# Altium project RD15002SCT_Collection_20160216.PrjPcb
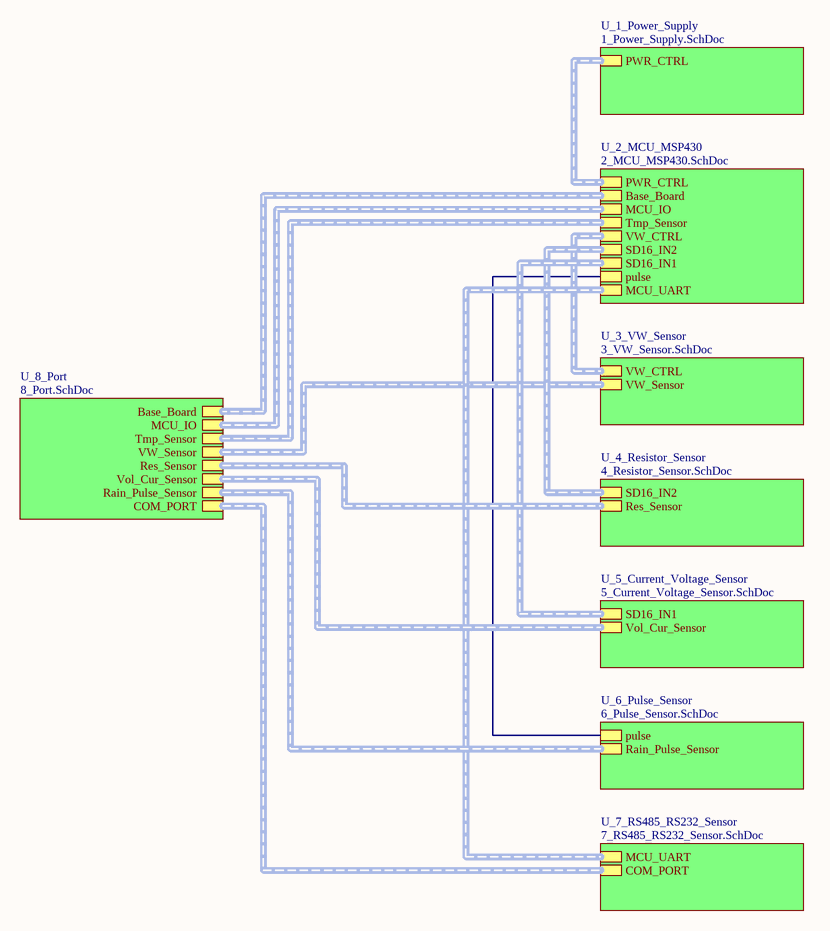
[diagram p0: RD15002SCT_Collection.SchDoc]
9 sheets, 184 parts. Net scope: hierarchical (ports join the sheet entries above them; power ports are global).
Board files: RD15002SCT_Collection.PcbDoc, RD15002SCT拼板20160225.PcbDoc
Sheets:
  RD15002SCT_Collection.SchDoc
    U_1_Power_Supply = 1_Power_Supply.SchDoc
    U_3_VW_Sensor = 3_VW_Sensor.SchDoc
    U_4_Resistor_Sensor = 4_Resistor_Sensor.SchDoc
    U_5_Current_Voltage_Sensor = 5_Current_Voltage_Sensor.SchDoc
    U_6_Pulse_Sensor = 6_Pulse_Sensor.SchDoc
    U_7_RS485_RS232_Sensor = 7_RS485_RS232_Sensor.SchDoc
    U_2_MCU_MSP430 = 2_MCU_MSP430.SchDoc
    U_8_Port = 8_Port.SchDoc

## Sheet RD15002SCT_Collection.SchDoc
size A4

### Sub-sheets
U_1_Power_Supply = 1_Power_Supply.SchDoc: PWR_CTRL (harness PWR_CTRL)
U_2_MCU_MSP430 = 2_MCU_MSP430.SchDoc: MCU_UART (harness MCU_UART), PWR_CTRL (harness PWR_CTRL), SD16_IN1 (harness SD16_IN1), SD16_IN2 (harness SD16_IN2), pulse, Tmp_Sensor (harness Tmp_Sensor), VW_CTRL (harness VW_CTRL), MCU_IO (harness MCU_IO), Base_Board (harness Base_Board)
U_3_VW_Sensor = 3_VW_Sensor.SchDoc: VW_CTRL (harness VW_CTRL), VW_Sensor (harness VW_Sensor)
U_4_Resistor_Sensor = 4_Resistor_Sensor.SchDoc: SD16_IN2 (harness SD16_IN2), Res_Sensor (harness Res_Sensor)
U_5_Current_Voltage_Sensor = 5_Current_Voltage_Sensor.SchDoc: SD16_IN1 (harness SD16_IN1), Vol_Cur_Sensor (harness Vol_Cur_Sensor)
U_6_Pulse_Sensor = 6_Pulse_Sensor.SchDoc: pulse, Rain_Pulse_Sensor (harness Rain_Pulse_Sensor)
U_7_RS485_RS232_Sensor = 7_RS485_RS232_Sensor.SchDoc: COM_PORT (harness COM_PORT), MCU_UART (harness MCU_UART)
U_8_Port = 8_Port.SchDoc: Rain_Pulse_Sensor (harness Rain_Pulse_Sensor), VW_Sensor (harness VW_Sensor), Vol_Cur_Sensor (harness Vol_Cur_Sensor), Tmp_Sensor (harness Tmp_Sensor), Res_Sensor (harness Res_Sensor), COM_PORT (harness COM_PORT), MCU_IO (harness MCU_IO), Base_Board (harness Base_Board)

### Nets
pulse: sheet U_6_Pulse_Sensor/pulse, sheet U_2_MCU_MSP430/pulse

### Buses and harness runs
harness sheet U_1_Power_Supply/PWR_CTRL = sheet U_2_MCU_MSP430/PWR_CTRL
harness sheet U_2_MCU_MSP430/Base_Board = sheet U_8_Port/Base_Board
harness sheet U_2_MCU_MSP430/MCU_IO = sheet U_8_Port/MCU_IO
harness sheet U_2_MCU_MSP430/MCU_UART = sheet U_7_RS485_RS232_Sensor/MCU_UART
harness sheet U_2_MCU_MSP430/SD16_IN1 = sheet U_5_Current_Voltage_Sensor/SD16_IN1
harness sheet U_2_MCU_MSP430/SD16_IN2 = sheet U_4_Resistor_Sensor/SD16_IN2
harness sheet U_2_MCU_MSP430/Tmp_Sensor = sheet U_8_Port/Tmp_Sensor
harness sheet U_2_MCU_MSP430/VW_CTRL = sheet U_3_VW_Sensor/VW_CTRL
harness sheet U_3_VW_Sensor/VW_Sensor = sheet U_8_Port/VW_Sensor
harness sheet U_4_Resistor_Sensor/Res_Sensor = sheet U_8_Port/Res_Sensor
harness sheet U_5_Current_Voltage_Sensor/Vol_Cur_Sensor = sheet U_8_Port/Vol_Cur_Sensor
harness sheet U_6_Pulse_Sensor/Rain_Pulse_Sensor = sheet U_8_Port/Rain_Pulse_Sensor
harness sheet U_7_RS485_RS232_Sensor/COM_PORT = sheet U_8_Port/COM_PORT

### Notes on the sheet
- 文件版本:
- 原理图名:
- 工 程  名:
- 绘       制:
- 审       核:
- 第   页，共    页
- 日       期:

## Sheet 1_Power_Supply.SchDoc
size A4
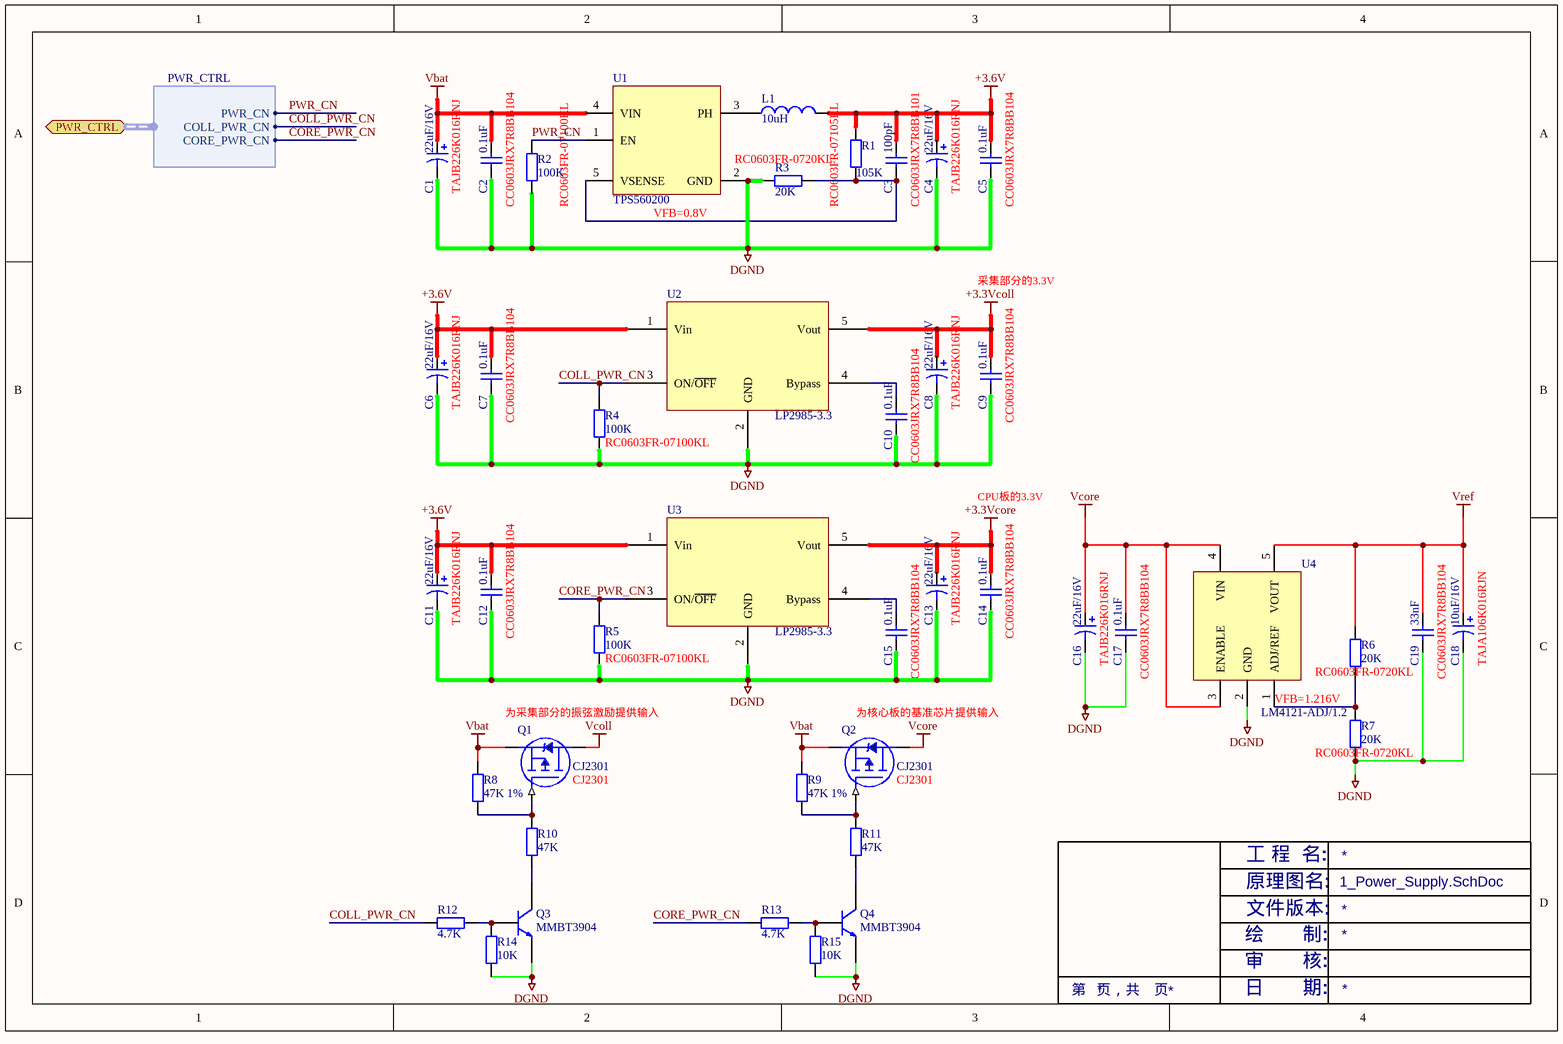
[diagram p1: 1_Power_Supply.SchDoc]

### Parts
C1  22uF/16V  Part No.: TAJB226K016RNJ  [CB3528]
C2  0.1uF  Type No.: CC0603JRX7R8BB104  [CC0603]
C3  100pF  Type No.: CC0603JRX7R8BB101  [CC0603]
C4  22uF/16V  Part No.: TAJB226K016RNJ  [CB3528]
C5  0.1uF  Type No.: CC0603JRX7R8BB104  [CC0603]
C6  22uF/16V  Part No.: TAJB226K016RNJ  [CB3528]
C7  0.1uF  Type No.: CC0603JRX7R8BB104  [CC0603]
C8  22uF/16V  Part No.: TAJB226K016RNJ  [CB3528]
C9  0.1uF  Type No.: CC0603JRX7R8BB104  [CC0603]
C10  0.1uF  Type No.: CC0603JRX7R8BB104  [CC0603]
C11  22uF/16V  Part No.: TAJB226K016RNJ  [CB3528]
C12  0.1uF  Type No.: CC0603JRX7R8BB104  [CC0603]
C13  22uF/16V  Part No.: TAJB226K016RNJ  [CB3528]
C14  0.1uF  Type No.: CC0603JRX7R8BB104  [CC0603]
C15  0.1uF  Type No.: CC0603JRX7R8BB104  [CC0603]
C16  22uF/16V  Part No.: TAJB226K016RNJ  [CB3528]
C17  0.1uF  Type No.: CC0603JRX7R8BB104  [CC0603]
C18  10uF/16V  Type No.: TAJA106K016RJN  [CA3216]
C19  33nF  Type No.: CC0603JRX7R8BB104  [CC0603]
L1  10uH  [SLF6025]
Q1  CJ2301  [SOT-23W]
Q2  CJ2301  [SOT-23W]
Q3  MMBT3904  [SOT-23W]
Q4  MMBT3904  [SOT-23W]
R1  105K  Type No.: RC0603FR-07105KL  [CC0603]
R2  100K  Type No.: RC0603FR-07100KL  [CC0603]
R3  20K  Type No.: RC0603FR-0720KL  [CC0603]
R4  100K  Type No.: RC0603FR-07100KL  [CC0603]
R5  100K  Type No.: RC0603FR-07100KL  [CC0603]
R6  20K  Type No.: RC0603FR-0720KL  [CC0603]
R7  20K  Type No.: RC0603FR-0720KL  [CC0603]
R8  47K 1%  [CC0603]
R9  47K 1%  [CC0603]
R10  47K  [CC0603]
R11  47K  [CC0603]
R12  4.7K  [CC0603]
R13  4.7K  [CC0603]
R14  10K  [CC0603]
R15  10K  [CC0603]
U1  TPS560200  [SOT-23-5]
U2  LP2985-3.3  [SOT-23-5]
U3  LP2985-3.3  [SOT-23-5]
U4  LM4121-ADJ/1.2  [SOT-23-5]

### Ports
PWR_CTRL (harness PWR_CTRL)

### Harnesses
PWR_CTRL: PWR_CN, COLL_PWR_CN, CORE_PWR_CN

### Nets
+3.3Vcoll: C8.1 C9.2 U2.5(Vout)
+3.3Vcore: C13.1 C14.2 U3.5(Vout)
+3.6V: C3.2 C4.1 C5.2 C6.1 C7.2 C11.1 C12.2 L1.2 R1.1 U2.1(Vin) U3.1(Vin)
DGND: C1.2 C2.1 C4.2 C5.1 C6.2 C7.1 C8.2 C9.1 C10.1 C11.2 C12.1 C13.2 C14.1 C15.1 C16.2 C17.1 C18.2 C19.1 Q3.2 Q4.2 R2.2 R3.2 R4.2 R5.2 R7.2 R14.2 R15.2 U1.2(GND) U2.2(GND) U3.2(GND) U4.2(GND)
Vbat: C1.1 C2.2 Q1.2(SOURCE) Q2.2(SOURCE) R8.1 R9.1 U1.4(VIN)
Vcoll: Q1.3(DRAIN)
Vcore: C16.1 C17.2 Q2.3(DRAIN) U4.3(ENABLE) U4.4(VIN)
Vref: C18.1 C19.2 R6.1 U4.5(VOUT)
COLL_PWR_CN: R4.1 R12.1 U2.3(ON/~{OFF}) ; port PWR_CTRL.COLL_PWR_CN
CORE_PWR_CN: R5.1 R13.1 U3.3(ON/~{OFF}) ; port PWR_CTRL.CORE_PWR_CN
PWR_CN: R2.1 U1.1(EN) ; port PWR_CTRL.PWR_CN
NetC3_1: C3.1 R1.2 R3.1 U1.5(VSENSE)
NetC10_2: C10.2 U2.4(Bypass)
NetC15_2: C15.2 U3.4(Bypass)
NetL1_1: L1.1 U1.3(PH)
NetQ1_1: Q1.1(GATE) R8.2 R10.1
NetQ2_1: Q2.1(GATE) R9.2 R11.1
NetQ3_1: Q3.1 R12.2 R14.1
NetQ3_3: Q3.3 R10.2
NetQ4_1: Q4.1 R13.2 R15.1
NetQ4_3: Q4.3 R11.2
NetR6_2: R6.2 R7.1 U4.1(ADJ/REF)

### Notes on the sheet
- (near U1) VFB=0.8V
- 采集部分的3.3V
- CPU板的3.3V
- (near Q1) 为采集部分的振弦激励提供输入
- (near Q2) 为核心板的基准芯片提供输入
- (near U4) VFB=1.216V
- 文件版本:
- 原理图名:
- 工 程  名:
- 绘       制:
- 审       核:
- 第   页，共    页
- 日       期:

### Library data of the parts
C1 C4 C6 C8 C11 C13 C16 C18 = Cap Pol1: Polarized Capacitor (Radial)
C2 C3 C5 C7 C9 C10 C12 C14 C15 C17 C19 = Cap: Capacitor
L1 = Inductor: Code_IEC: 1005; Value: 10mH; Published: 8-Jun-2000; LatestRevisionDate: 29-May-2009; LatestRevisionNote: IPC-7351 Footprint Added.; PackageReference: 0402-A; Publisher: Altium Limited; PackageDescription: Chip Inductor; Code_JEITA: 0402
Q1 Q2 = P-MOSFET1: Type No.: CJ2301
Q3 Q4 = NPN
R1-R7 R14 R15 = Res2: Resistor
  R14 R15: Published: 8-Jun-2000; LatestRevisionDate: 17-Jul-2002; LatestRevisionNote: Re-released for DXP Platform.; PackageReference: AXIAL-0.4; Publisher: Altium Limited; PackageDescription: Axial Device, Thru-Hole; 2 Leads; 0.4 in Pin Spacing; Value: 10K
R8-R13 = Res2: Resistor; Value: 10K; Published: 8-Jun-2000; LatestRevisionDate: 17-Jul-2002; LatestRevisionNote: Re-released for DXP Platform.; PackageReference: AXIAL-0.4; Publisher: Altium Limited; PackageDescription: Axial Device, Thru-Hole; 2 Leads; 0.4 in Pin Spacing
U2 U3 = LP2985

## Sheet 3_VW_Sensor.SchDoc
size A4
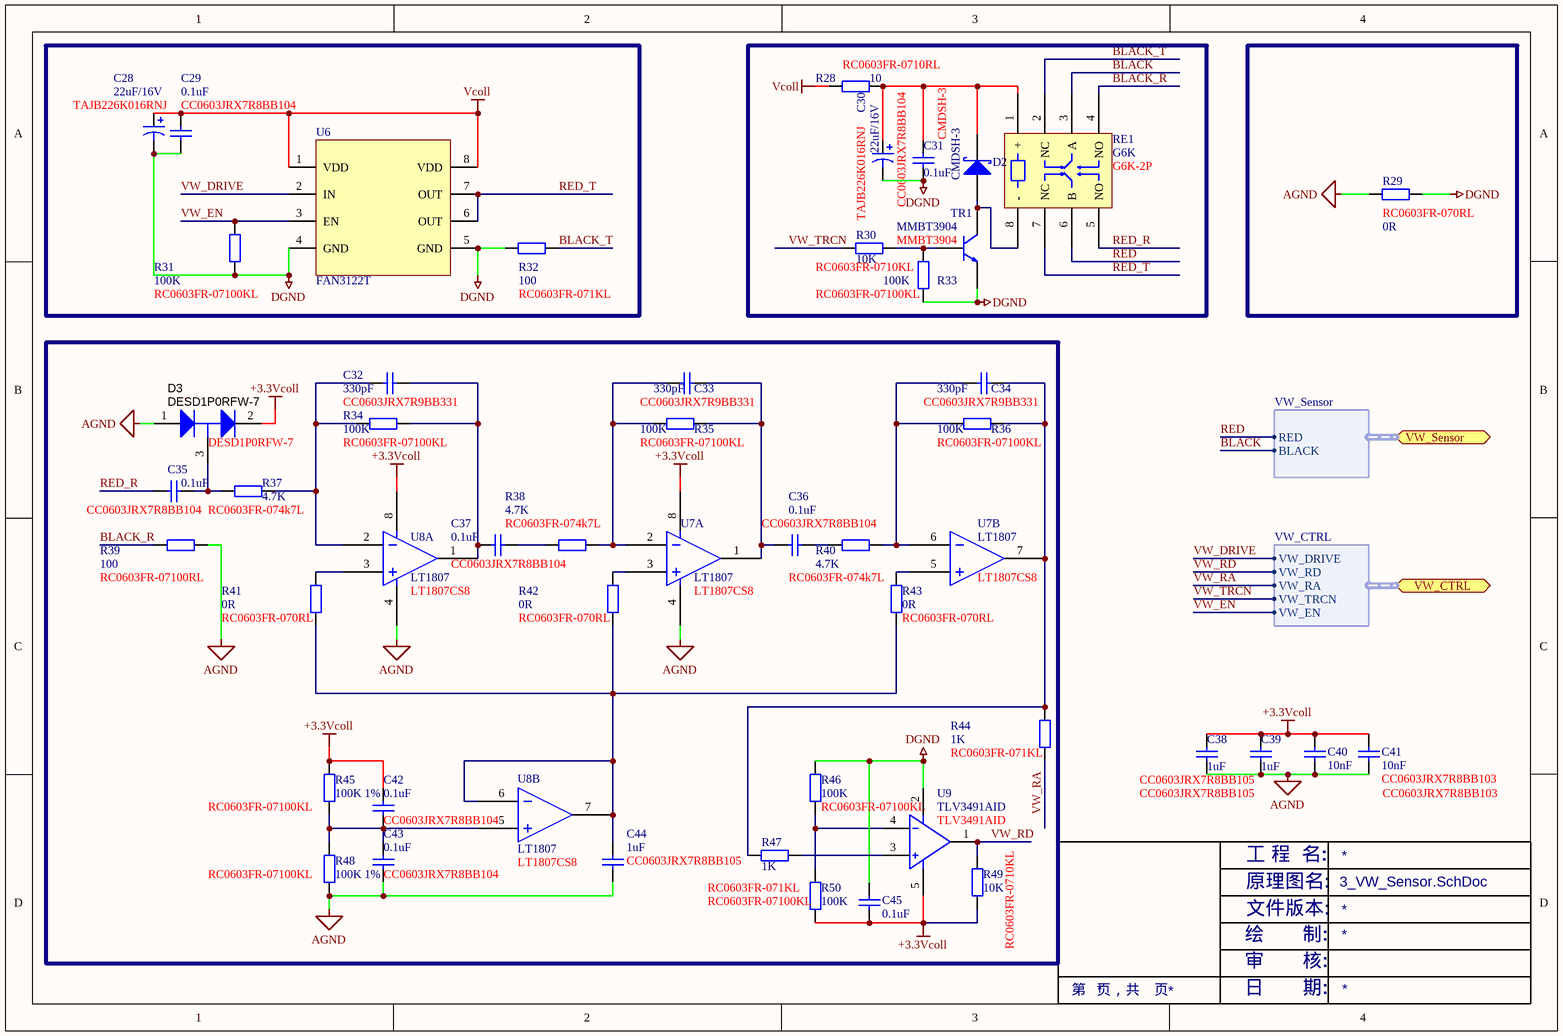
[diagram p2: 3_VW_Sensor.SchDoc]

### Parts
C28  22uF/16V  Part No.: TAJB226K016RNJ  [CB3528]
C29  0.1uF  Type No.: CC0603JRX7R8BB104  [CC0603]
C30  22uF/16V  Part No.: TAJB226K016RNJ  [CB3528]
C31  0.1uF  Type No.: CC0603JRX7R8BB104  [CC0603]
C32  330pF  Type No.: CC0603JRX7R9BB331  [CC0603]
C33  330pF  Type No.: CC0603JRX7R9BB331  [CC0603]
C34  330pF  Type No.: CC0603JRX7R9BB331  [CC0603]
C35  0.1uF  Type No.: CC0603JRX7R8BB104  [CC0603]
C36  0.1uF  Type No.: CC0603JRX7R8BB104  [CC0603]
C37  0.1uF  Type No.: CC0603JRX7R8BB104  [CC0603]
C38  1uF  Type No.: CC0603JRX7R8BB105  [CC0603]
C39  1uF  Type No.: CC0603JRX7R8BB105  [CC0603]
C40  10nF  Type No.: CC0603JRX7R8BB103  [CC0603]
C41  10nF  Type No.: CC0603JRX7R8BB103  [CC0603]
C42  0.1uF  Type No.: CC0603JRX7R8BB104  [CC0603]
C43  0.1uF  Type No.: CC0603JRX7R8BB104  [CC0603]
C44  1uF  Type No.: CC0603JRX7R8BB105  [CC0603]
C45  0.1uF  [CC0603]
D2  CMDSH-3  [SOD323]
D3  DESD1P0RFW-7  [SOT-323]
R28  10  Type No.: RC0603FR-0710RL  [CC0603]
R29  0R  Type No.: RC0603FR-070RL  [CC0603]
R30  10K  Type No.: RC0603FR-0710KL  [CC0603]
R31  100K  Type No.: RC0603FR-07100KL  [CC0603]
R32  100  Type No.: RC0603FR-071KL  [CC0603]
R33  100K  Type No.: RC0603FR-07100KL  [CC0603]
R34  100K  Type No.: RC0603FR-07100KL  [CC0603]
R35  100K  Type No.: RC0603FR-07100KL  [CC0603]
R36  100K  Type No.: RC0603FR-07100KL  [CC0603]
R37  4.7K  Type No.: RC0603FR-074k7L  [CC0603]
R38  4.7K  Type No.: RC0603FR-074k7L  [CC0603]
R39  100  Type No.: RC0603FR-07100RL  [CC0603]
R40  4.7K  Type No.: RC0603FR-074k7L  [CC0603]
R41  0R  Type No.: RC0603FR-070RL  [CC0603]
R42  0R  Type No.: RC0603FR-070RL  [CC0603]
R43  0R  Type No.: RC0603FR-070RL  [CC0603]
R44  1K  Type No.: RC0603FR-071KL  [CC0603]
R45  100K 1%  Type No.: RC0603FR-07100KL  [CC0603]
R46  100K  Type No.: RC0603FR-07100KL  [CC0603]
R47  1K  Type No.: RC0603FR-071KL  [CC0603]
R48  100K 1%  Type No.: RC0603FR-07100KL  [CC0603]
R49  10K  Type No.: RC0603FR-0710KL  [CC0603]
R50  100K  Type No.: RC0603FR-07100KL  [CC0603]
RE1  G6K  Type No.: G6K-2P  [G6K]
TR1  MMBT3904  [SOT-23W]
U6  FAN3122T  [SO-8]
U7  LT1807  Type No.: LT1807CS8  [SO-8]  (parts A,B of 2)
U8  LT1807  Type No.: LT1807CS8  [SO-8]  (parts A,B of 2)
U9  TLV3491AID  [SOT-23-5]

### Ports
VW_CTRL (harness VW_CTRL), VW_Sensor (harness VW_Sensor)

### Harnesses
VW_CTRL: VW_RA, VW_DRIVE, VW_TRCN, VW_EN, VW_RD
VW_Sensor: RED, BLACK

### Nets
+3.3Vcoll: C38.2 C39.2 C40.1 C41.1 C42.1 C45.2 D3.2(K) R45.1 R49.1 R50.1 U7.8 U8.8 U9.5(+VS)
AGND: C38.1 C39.1 C40.2 C41.2 C43.2 C44.1 D3.1(A) R29.1 R39.2 R48.2 U7.4 U8.4
DGND: C28.2 C29.1 C30.2 C31.2 C45.1 R29.2 R31.2 R32.2 R33.1 R46.2 TR1.2 U6.4(GND) U6.5(GND) U9.2(-VS)
Vcoll: C28.1 C29.2 R28.1 U6.1(VDD) U6.8(VDD)
BLACK: RE1.3(A) ; port VW_Sensor.BLACK
BLACK_R: R39.1 RE1.4(NO)
BLACK_T: R32.1 RE1.2(NC)
RED: RE1.6(B) ; port VW_Sensor.RED
RED_R: C35.2 RE1.5(NO)
RED_T: RE1.7(NC) U6.6(OUT) U6.7(OUT)
VW_DRIVE: U6.2(IN) ; port VW_CTRL.VW_DRIVE
VW_EN: R31.1 U6.3(EN) ; port VW_CTRL.VW_EN
VW_RA: R44.2 ; port VW_CTRL.VW_RA
VW_RD: R49.2 U9.1(OUT) ; port VW_CTRL.VW_RD
VW_TRCN: R30.1 ; port VW_CTRL.VW_TRCN
NetC30_1: C30.1 C31.1 D2.2(K) R28.2 RE1.1(+)
NetC32_1: C32.1 C37.2 R34.1 U8.1
NetC32_2: C32.2 R34.2 R37.1 U8.2
NetC33_1: C33.1 C36.2 R35.1 U7.1
NetC33_2: C33.2 R35.2 R38.1 U7.2
NetC34_1: C34.1 R36.1 R44.1 R47.2 U7.7
NetC34_2: C34.2 R36.2 R40.1 U7.6
NetC35_1: C35.1 D3.3(C) R37.2
NetC36_1: C36.1 R40.2
NetC37_1: C37.1 R38.2
NetC42_2: C42.2 C43.1 R45.2 R48.1 U8.5
NetC44_2: C44.2 R41.2 R42.2 R43.2 U8.6 U8.7
NetD2_1: D2.1(A) RE1.8(-) TR1.3
NetR30_2: R30.2 R33.2 TR1.1
NetR41_1: R41.1 U8.3
NetR42_1: R42.1 U7.3
NetR43_1: R43.1 U7.5
NetR46_1: R46.1 R50.2 U9.4(-)
NetR47_1: R47.1 U9.3(+)

### Notes on the sheet
- 文件版本:
- 原理图名:
- 工 程  名:
- 绘       制:
- 审       核:
- 第   页，共    页
- 日       期:

### Library data of the parts
C28 C30 = Cap Pol1: Polarized Capacitor (Radial)
C29 C31-C45 = Cap: Capacitor
  C45: Published: 8-Jun-2000; LatestRevisionDate: 17-Jul-2002; LatestRevisionNote: Re-released for DXP Platform.; PackageReference: RAD-0.3; Publisher: Altium Limited; Value: 0.1uF
D2 = D Schottky: Schottky Diode; Type No.: CMDSH-3
D3 = BAV99WT1G: TVS DIODE,70VVVM,8VC,SOT-323; Type No.: DESD1P0RFW-7
R28-R50 = Res2: Resistor
TR1 = NPN: Type No.: MMBT3904
U6 = FAN3122
U7 U8 = LM833N
U9 = TLV3491AID: Type No.: TLV3491AID

## Sheet 4_Resistor_Sensor.SchDoc
size A4
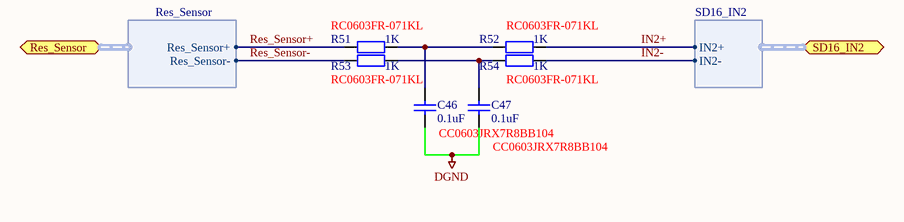
[diagram p3: 4_Resistor_Sensor.SchDoc]

### Parts
C46  0.1uF  Type No.: CC0603JRX7R8BB104  [CC0603]
C47  0.1uF  Type No.: CC0603JRX7R8BB104  [CC0603]
R51  1K  Type No.: RC0603FR-071KL  [CC0603]
R52  1K  Type No.: RC0603FR-071KL  [CC0603]
R53  1K  Type No.: RC0603FR-071KL  [CC0603]
R54  1K  Type No.: RC0603FR-071KL  [CC0603]

### Ports
Res_Sensor (harness Res_Sensor), SD16_IN2 (harness SD16_IN2)

### Harnesses
SD16_IN2: IN2+, IN2-
Res_Sensor: Res_Sensor+, Res_Sensor-

### Nets
DGND: C46.2 C47.2
IN2+: R52.1 ; port SD16_IN2.IN2+
IN2-: R54.1 ; port SD16_IN2.IN2-
Res_Sensor+: R51.2 ; port Res_Sensor.Res_Sensor+
Res_Sensor-: R53.2 ; port Res_Sensor.Res_Sensor-
NetC46_1: C46.1 R51.1 R52.2
NetC47_1: C47.1 R53.1 R54.2

### Notes on the sheet
- 文件版本:
- 原理图名:
- 工 程  名:
- 绘       制:
- 审       核:
- 第   页，共    页
- 日       期:

### Library data of the parts
C46 C47 = Cap: Capacitor
R51-R54 = Res2: Resistor

## Sheet 5_Current_Voltage_Sensor.SchDoc
size A4
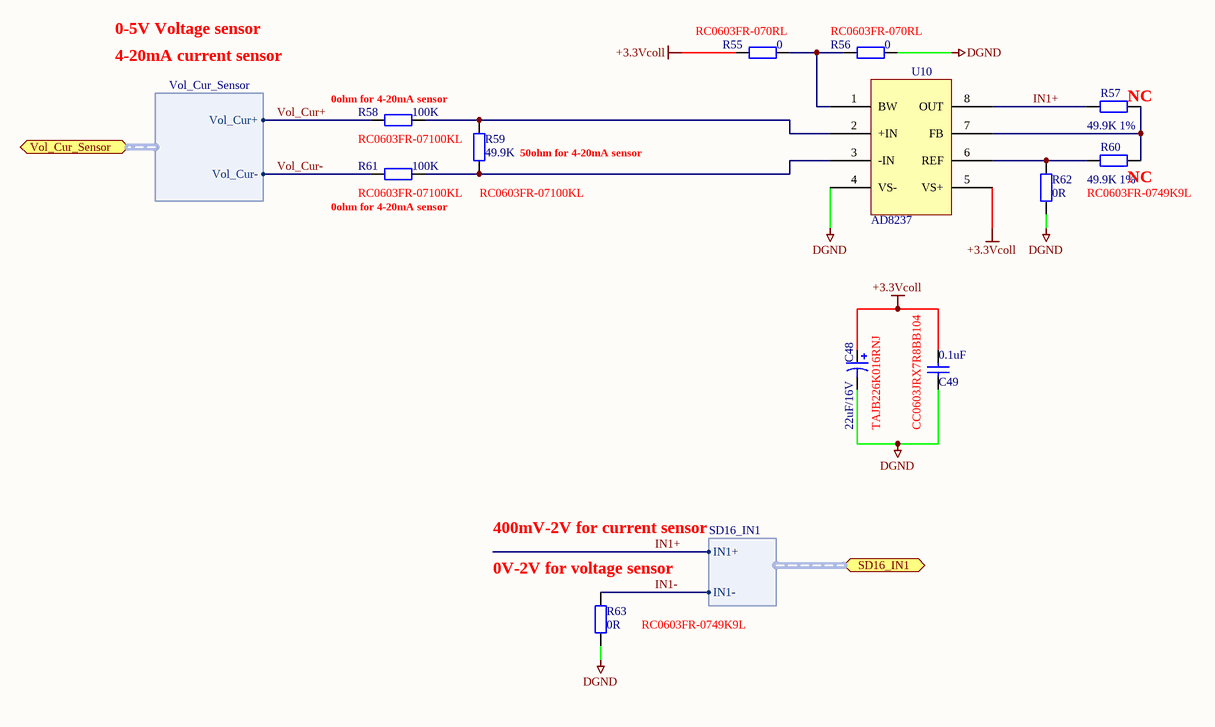
[diagram p4: 5_Current_Voltage_Sensor.SchDoc]

### Parts
C48  22uF/16V  Part No.: TAJB226K016RNJ  [CB3528]
C49  0.1uF  Type No.: CC0603JRX7R8BB104  [CC0603]
R55  0  Type No.: RC0603FR-070RL  [CC0603]
R56  0  Type No.: RC0603FR-070RL  [CC0603]
R57  49.9K 1%  [CC0603]
R58  100K  Type No.: RC0603FR-07100KL  [CC0603]
R59  49.9K  Type No.: RC0603FR-07100KL  [CC0603]
R60  49.9K 1%  [CC0603]
R61  100K  Type No.: RC0603FR-07100KL  [CC0603]
R62  0R  Type No.: RC0603FR-0749K9L  [CC0603]
R63  0R  Type No.: RC0603FR-0749K9L  [CC0603]
U10  AD8237  [MSOP8]

### Ports
SD16_IN1 (harness SD16_IN1), Vol_Cur_Sensor (harness Vol_Cur_Sensor)

### Harnesses
SD16_IN1: IN1+, IN1-
Vol_Cur_Sensor: Vol_Cur+, Vol_Cur-

### Nets
+3.3Vcoll: C48.1 C49.2 R55.2 U10.5(VS+)
DGND: C48.2 C49.1 R56.1 R62.2 R63.2 U10.4(VS-)
IN1+: R57.2 U10.8(OUT) ; port SD16_IN1.IN1+
IN1-: R63.1 ; port SD16_IN1.IN1-
Vol_Cur+: R58.2 ; port Vol_Cur_Sensor.Vol_Cur+
Vol_Cur-: R61.2 ; port Vol_Cur_Sensor.Vol_Cur-
NetR55_1: R55.1 R56.2 U10.1(BW)
NetR57_1: R57.1 R60.1 U10.7(FB)
NetR58_1: R58.1 R59.1 U10.2(+IN)
NetR59_2: R59.2 R61.1 U10.3(-IN)
NetR60_2: R60.2 R62.1 U10.6(REF)

### Notes on the sheet
- 0-5V Voltage sensor
- 4-20mA current sensor
- (near R58) 0ohm for 4-20mA sensor
- (near R57) NC
- (near R59) 50ohm for 4-20mA sensor
- (near R61) 0ohm for 4-20mA sensor
- (near R60) NC
- 400mV-2V for current sensor
- (near R63) 0V-2V for voltage sensor
- 文件版本:
- 原理图名:
- 工 程  名:
- 绘       制:
- 审       核:
- 第   页，共    页
- 日       期:

### Library data of the parts
C48 = Cap Pol1: Polarized Capacitor (Radial)
C49 = Cap: Capacitor
R55 R56 R58 R59 R61-R63 = Res2: Resistor
R57 R60 = Res2: Resistor; Value: 1K; Published: 8-Jun-2000; LatestRevisionDate: 17-Jul-2002; LatestRevisionNote: Re-released for DXP Platform.; PackageReference: AXIAL-0.4; Publisher: Altium Limited
U10 = AD8237: Type No.: AD8237ARMZ

## Sheet 6_Pulse_Sensor.SchDoc
size A4
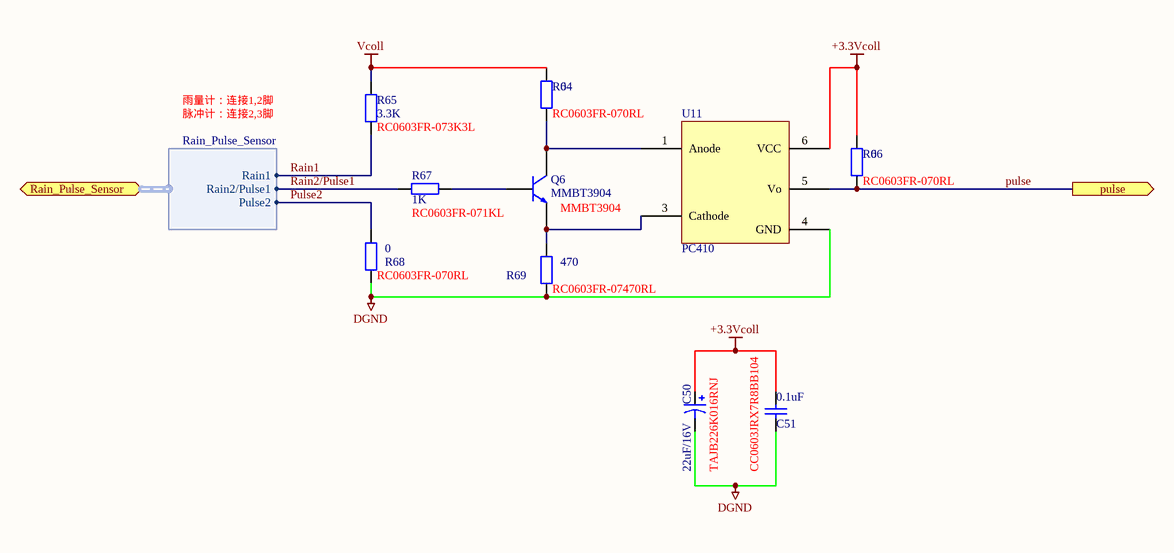
[diagram p5: 6_Pulse_Sensor.SchDoc]

### Parts
C50  22uF/16V  Part No.: TAJB226K016RNJ  [CB3528]
C51  0.1uF  Type No.: CC0603JRX7R8BB104  [CC0603]
Q6  MMBT3904  [SOT-23W]
R64  0  Type No.: RC0603FR-070RL  [CC0603]
R65  3.3K  Type No.: RC0603FR-073K3L  [CC0603]
R66  0  Type No.: RC0603FR-070RL  [CC0603]
R67  1K  Type No.: RC0603FR-071KL  [CC0603]
R68  0  Type No.: RC0603FR-070RL  [CC0603]
R69  470  Type No.: RC0603FR-07470RL  [CC0603]
U11  PC410  [PC410]

### Ports
pulse, Rain_Pulse_Sensor (harness Rain_Pulse_Sensor)

### Harnesses
Rain_Pulse_Sensor: Rain1, Rain2/Pulse1, Pulse2

### Nets
+3.3Vcoll: C50.1 C51.2 R66.1 U11.6(VCC)
DGND: C50.2 C51.1 R68.2 R69.2 U11.4(GND)
Vcoll: R64.1 R65.1
pulse: R66.2 U11.5(Vo) ; port pulse
Pulse2: R68.1 ; port Rain_Pulse_Sensor.Pulse2
Rain1: R65.2 ; port Rain_Pulse_Sensor.Rain1
Rain2/Pulse1: R67.1 ; port Rain_Pulse_Sensor.Rain2/Pulse1
NetQ6_1: Q6.1 R67.2
NetQ6_2: Q6.2 R69.1 U11.3(Cathode)
NetQ6_3: Q6.3 R64.2 U11.1(Anode)

### Notes on the sheet
- 雨量计：连接1,2脚
- 脉冲计：连接2,3脚
- 文件版本:
- 原理图名:
- 工 程  名:
- 绘       制:
- 审       核:
- 第   页，共    页
- 日       期:

### Library data of the parts
C50 = Cap Pol1: Polarized Capacitor (Radial)
C51 = Cap: Capacitor
Q6 = NPN: Type No.: MMBT3904
R64-R69 = Res2: Resistor

## Sheet 7_RS485_RS232_Sensor.SchDoc
size A4
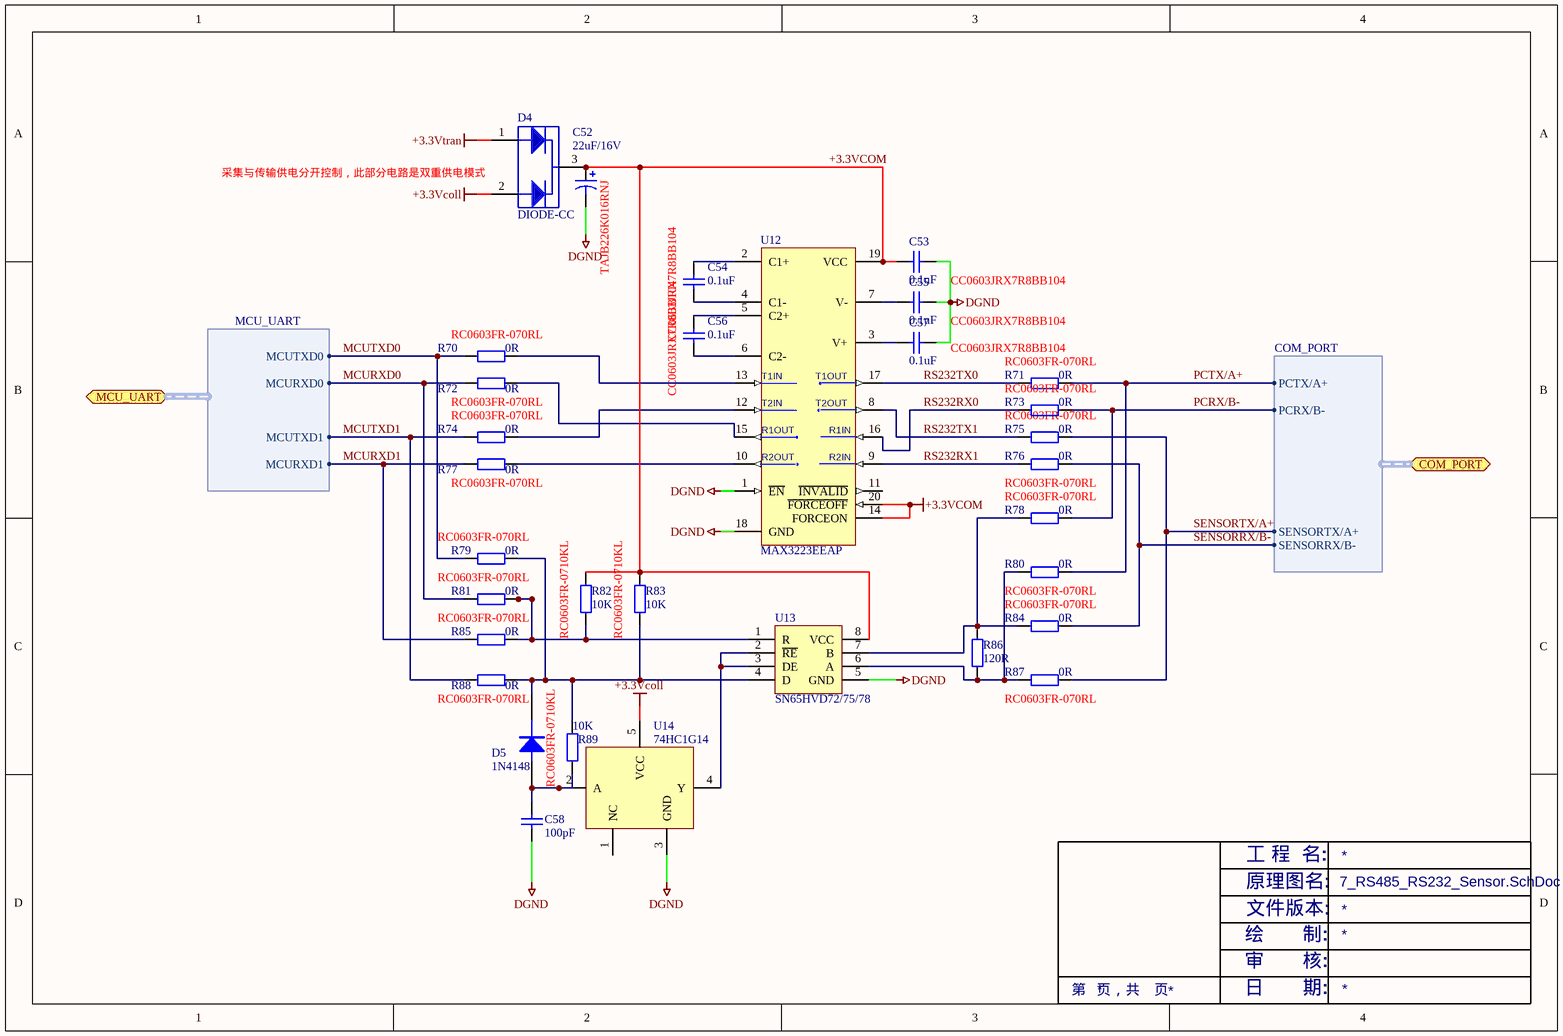
[diagram p6: 7_RS485_RS232_Sensor.SchDoc]

### Parts
C52  22uF/16V  Part No.: TAJB226K016RNJ  [CB3528]
C53  0.1uF  Type No.: CC0603JRX7R8BB104  [CC0603]
C54  0.1uF  Type No.: CC0603JRX7R8BB104  [CC0603]
C55  0.1uF  Type No.: CC0603JRX7R8BB104  [CC0603]
C56  0.1uF  Type No.: CC0603JRX7R8BB104  [CC0603]
C57  0.1uF  Type No.: CC0603JRX7R8BB104  [CC0603]
C58  100pF  [CC0603]
D4  DIODE-CC  [SOT-23W]
D5  1N4148  [SOD323]
R70  0R  Type No.: RC0603FR-070RL  [CC0603]
R71  0R  Type No.: RC0603FR-070RL  [CC0603]
R72  0R  Type No.: RC0603FR-070RL  [CC0603]
R73  0R  Type No.: RC0603FR-070RL  [CC0603]
R74  0R  Type No.: RC0603FR-070RL  [CC0603]
R75  0R  Type No.: RC0603FR-070RL  [CC0603]
R76  0R  Type No.: RC0603FR-070RL  [CC0603]
R77  0R  Type No.: RC0603FR-070RL  [CC0603]
R78  0R  Type No.: RC0603FR-070RL  [CC0603]
R79  0R  Type No.: RC0603FR-070RL  [CC0603]
R80  0R  Type No.: RC0603FR-070RL  [CC0603]
R81  0R  Type No.: RC0603FR-070RL  [CC0603]
R82  10K  Type No.: RC0603FR-0710KL  [CC0603]
R83  10K  Type No.: RC0603FR-0710KL  [CC0603]
R84  0R  Type No.: RC0603FR-070RL  [CC0603]
R85  0R  Type No.: RC0603FR-070RL  [CC0603]
R86  120R  [CC0603]
R87  0R  Type No.: RC0603FR-070RL  [CC0603]
R88  0R  Type No.: RC0603FR-070RL  [CC0603]
R89  10K  Type No.: RC0603FR-0710KL  [CC0603]
U12  MAX3223EEAP  [TSSOP20]
U13  SN65HVD72/75/78  [SO-8]
U14  74HC1G14  [SOT-23-5]

### Ports
COM_PORT (harness COM_PORT), MCU_UART (harness MCU_UART)

### Harnesses
MCU_UART: MCUTXD1, MCURXD1, MCURXD0, MCUTXD0
COM_PORT: PCTX/A+, PCRX/B-, SENSORRX/B-, SENSORTX/A+

### Nets
+3.3Vcoll: D4.2 U14.5(VCC)
+3.3VCOM: C52.1 C53.2 D4.3 R82.2 R83.2 U12.14(FORCEON) U12.19(VCC) U12.20(~{FORCEOFF}) U13.8(VCC)
+3.3Vtran: D4.1
DGND: C52.2 C53.1 C55.1 C57.1 C58.1 U12.1(~{EN}) U12.18(GND) U13.5(GND) U14.3(GND)
MCURXD0: R72.1 R81.1 ; port MCU_UART.MCURXD0
MCURXD1: R77.1 R85.1 ; port MCU_UART.MCURXD1
MCUTXD0: R70.1 R79.1 ; port MCU_UART.MCUTXD0
MCUTXD1: R74.1 R88.1 ; port MCU_UART.MCUTXD1
PCRX/B-: R73.2 R78.2 ; port COM_PORT.PCRX/B-
PCTX/A+: R71.2 R80.2 ; port COM_PORT.PCTX/A+
RS232RX0: R73.1 U12.16(R1IN)
RS232RX1: R76.1 U12.9(R2IN)
RS232TX0: R71.1 U12.17(T1OUT)
RS232TX1: R75.1 U12.8(T2OUT)
SENSORRX/B-: R76.2 R84.2 ; port COM_PORT.SENSORRX/B-
SENSORTX/A+: R75.2 R87.2 ; port COM_PORT.SENSORTX/A+
NetC54_1: C54.1 U12.4(C1-)
NetC54_2: C54.2 U12.2(C1+)
NetC55_2: C55.2 U12.7(V-)
NetC56_1: C56.1 U12.6(C2-)
NetC56_2: C56.2 U12.5(C2+)
NetC57_2: C57.2 U12.3(V+)
NetC58_2: C58.2 D5.1(A) R89.1 U14.2(A)
NetD5_2: D5.2(K) R79.2 R83.1 R88.2 R89.2 U13.4(D)
NetR70_2: R70.2 U12.13(T1IN)
NetR72_2: R72.2 U12.15(R1OUT)
NetR74_2: R74.2 U12.12(T2IN)
NetR77_2: R77.2 U12.10(R2OUT)
NetR78_1: R78.1 R84.1 R86.2 U13.7(B)
NetR80_1: R80.1 R86.1 R87.1 U13.6(A)
NetR81_2: R81.2 R82.1 R85.2 U13.1(R)
NetU13_2: U13.2(~{RE}) U13.3(DE) U14.4(Y)

Not connected (* = marked no-connect by the designer): U12 11(~{INVALID}); U14 1(NC)

### Notes on the sheet
- 采集与传输供电分开控制，此部分电路是双重供电模式
- 文件版本:
- 原理图名:
- 工 程  名:
- 绘       制:
- 审       核:
- 第   页，共    页
- 日       期:

### Library data of the parts
C52 = Cap Pol1: Polarized Capacitor (Radial)
C53-C58 = Cap: Capacitor
D5 = DIODE
R70-R85 R87-R89 = Res2: Resistor
R86 = Res2: Resistor; Value: 1K; Published: 8-Jun-2000; LatestRevisionDate: 17-Jul-2002; LatestRevisionNote: Re-released for DXP Platform.; PackageReference: AXIAL-0.4; Publisher: Altium Limited

## Sheet 2_MCU_MSP430.SchDoc
size A3
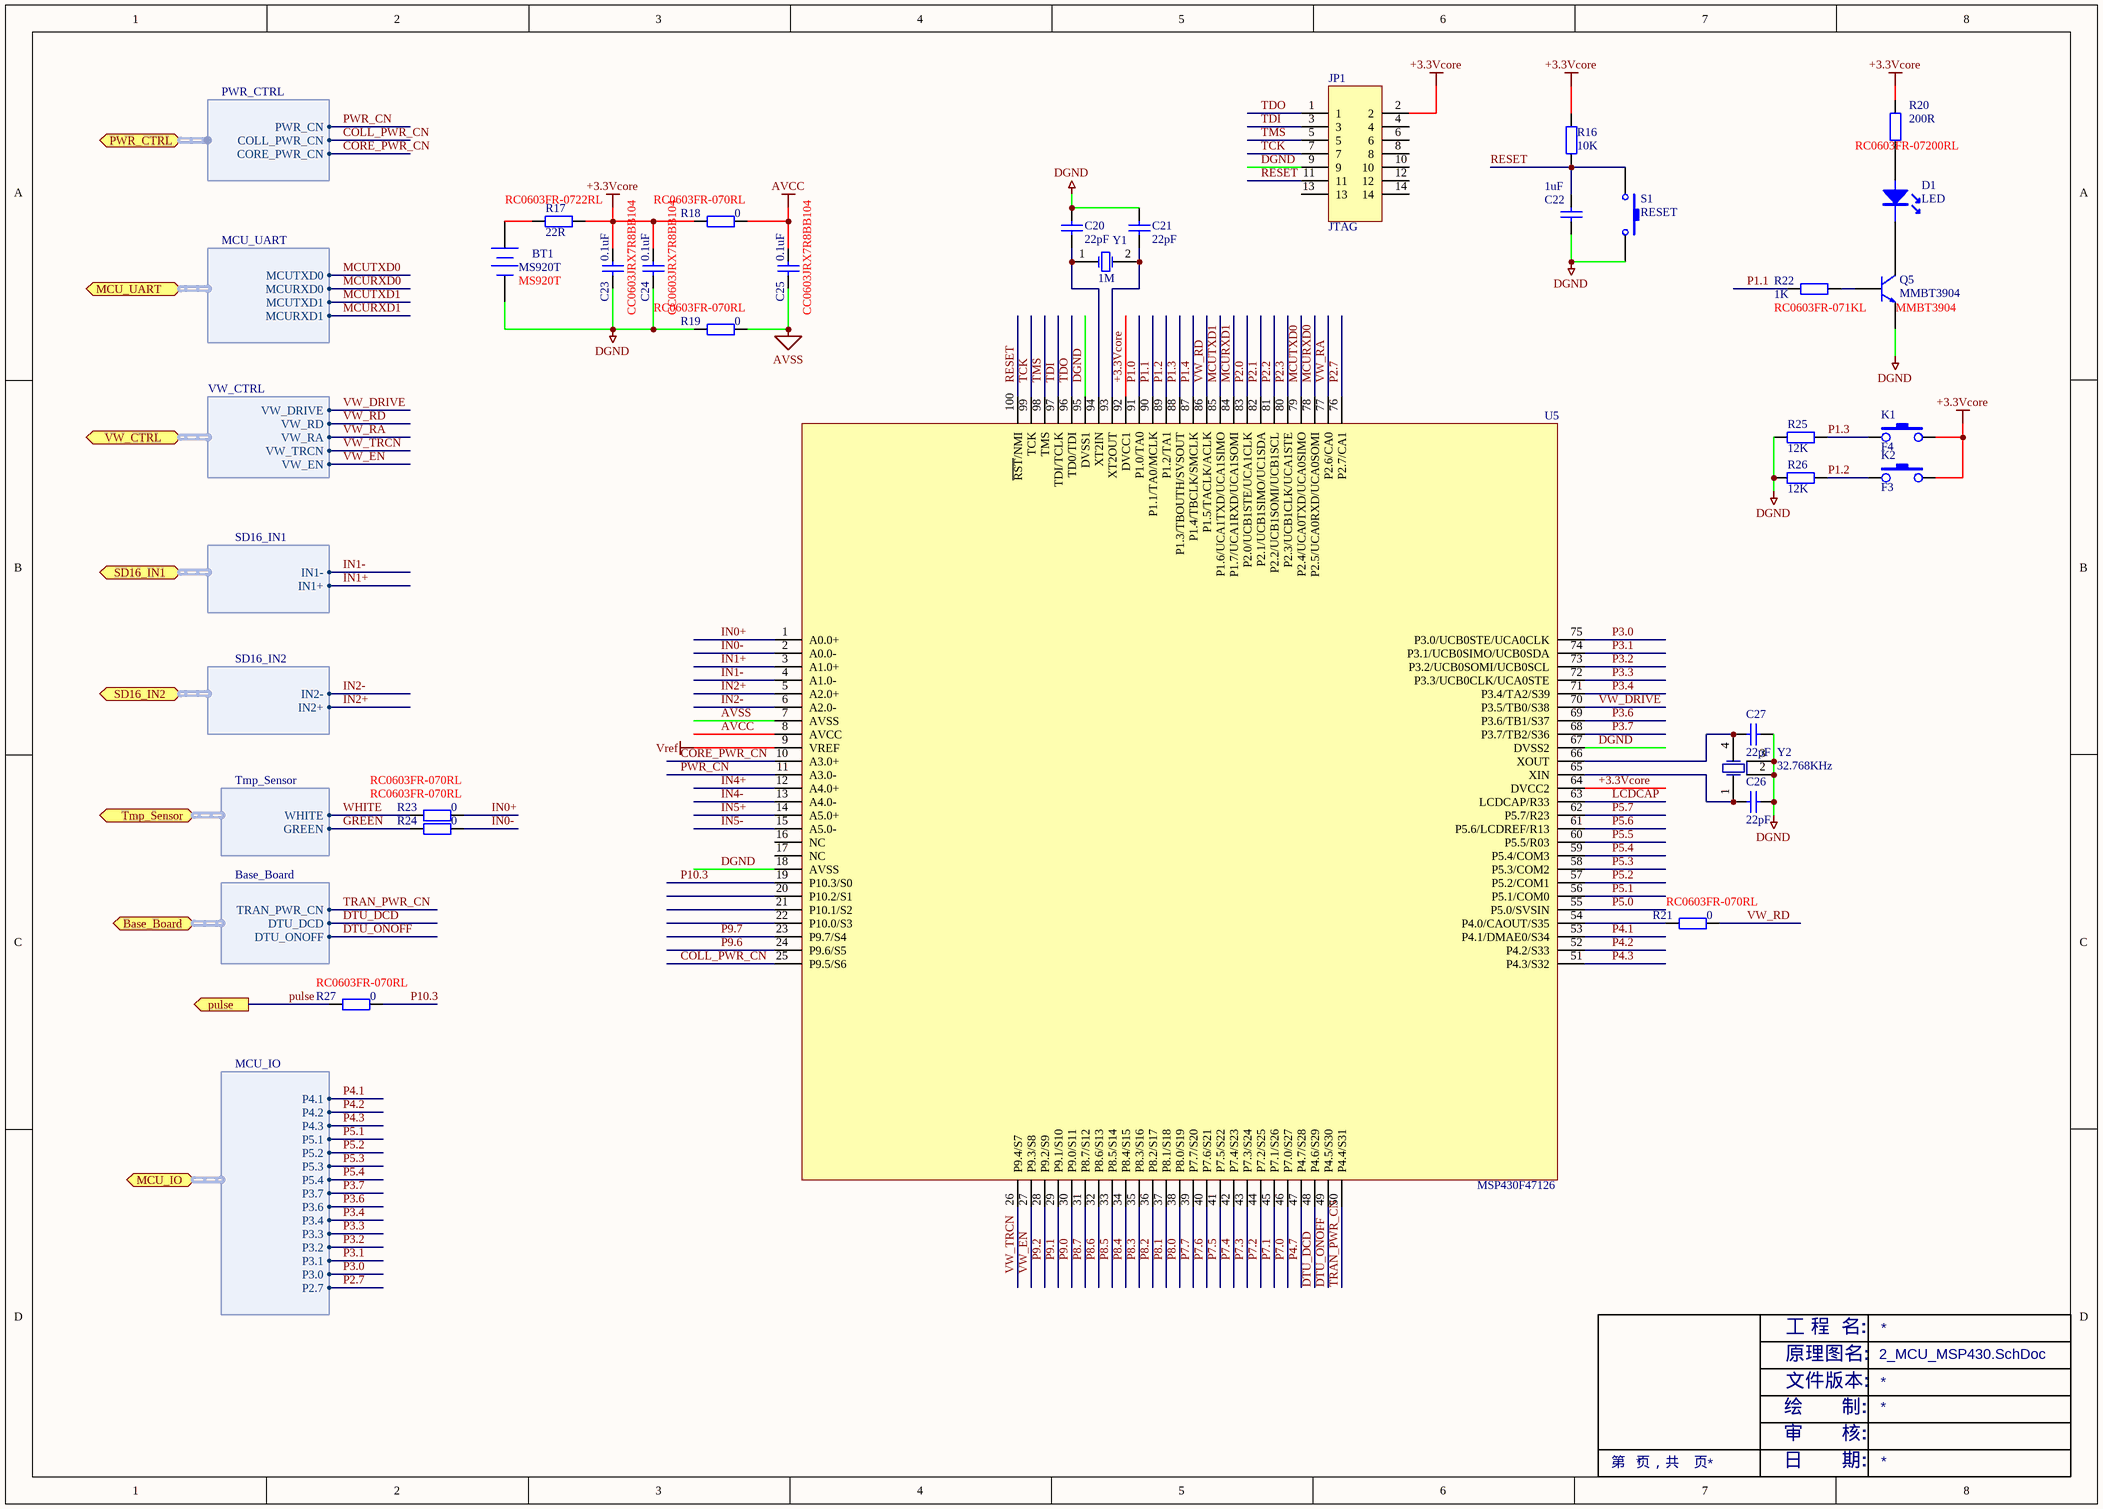
[diagram p7: 2_MCU_MSP430.SchDoc]

### Parts
BT1  MS920T  [MS920T]
C20  22pF  [CC0603]
C21  22pF  [CC0603]
C22  1uF  [CC0603]
C23  0.1uF  Type No.: CC0603JRX7R8BB104  [CC0603]
C24  0.1uF  Type No.: CC0603JRX7R8BB104  [CC0603]
C25  0.1uF  Type No.: CC0603JRX7R8BB104  [CC0603]
C26  22pF  [CC0603]
C27  22pF  [CC0603]
D1  LED  [D0805]
JP1  JTAG  [IDC14-2.0MM]
K1  F4  [SPST]
K2  F3  [SPST]
Q5  MMBT3904  [SOT-23W]
R16  10K  [CC0603]
R17  22R  Type No.: RC0603FR-0722RL  [CC0603]
R18  0  Type No.: RC0603FR-070RL  [CC0603]
R19  0  Type No.: RC0603FR-070RL  [CC0603]
R20  200R  Type No.: RC0603FR-07200RL  [CC0603]
R21  0  Type No.: RC0603FR-070RL  [CC0603]
R22  1K  Type No.: RC0603FR-071KL  [CC0603]
R23  0  Type No.: RC0603FR-070RL  [CC0603]
R24  0  Type No.: RC0603FR-070RL  [CC0603]
R25  12K  [CC0603]
R26  12K  [CC0603]
R27  0  Type No.: RC0603FR-070RL  [CC0603]
S1  RESET  [SPST]
U5  MSP430F47126  [TQFP100]
Y1  1M  [XCYAI]
Y2  32.768KHz  [MC-146]

### Ports
Base_Board (harness Base_Board), MCU_IO (harness MCU_IO), MCU_UART (harness MCU_UART), pulse, PWR_CTRL (harness PWR_CTRL), SD16_IN1 (harness SD16_IN1), SD16_IN2 (harness SD16_IN2), Tmp_Sensor (harness Tmp_Sensor), VW_CTRL (harness VW_CTRL)

### Harnesses
MCU_UART: MCUTXD1, MCURXD1, MCURXD0, MCUTXD0
PWR_CTRL: PWR_CN, COLL_PWR_CN, CORE_PWR_CN
SD16_IN1: IN1+, IN1-
SD16_IN2: IN2+, IN2-
Tmp_Sensor: GREEN, WHITE
VW_CTRL: VW_RA, VW_DRIVE, VW_TRCN, VW_EN, VW_RD
Base_Board: TRAN_PWR_CN, DTU_DCD, DTU_ONOFF
MCU_IO: P4.1, P4.2, P4.3, P5.1, P5.2, P5.3, P5.4, P3.0, P3.1, P3.2, P3.3, P3.4, P2.7, P3.6, P3.7

### Nets
+3.3Vcore: C23.2 C24.2 JP1.2 K1.2 K2.2 R16.2 R17.1 R18.2 R20.2 U5.64(DVCC2) U5.92(DVCC1)
AVCC: C25.2 R18.1 U5.8(AVCC)
AVSS: C25.1 R19.1 U5.7(AVSS)
DGND: BT1.2(-) C20.1 C21.1 C22.1 C23.1 C24.1 C26.2 C27.2 JP1.9 Q5.2 R19.2 R25.1 R26.1 S1.1 U5.18(AVSS) U5.67(DVSS2) U5.95(DVSS1) Y2.2(GND) Y2.3(GND)
Vref: U5.9(VREF)
COLL_PWR_CN: U5.25(P9.5/S6) ; port PWR_CTRL.COLL_PWR_CN
CORE_PWR_CN: U5.10(A3.0+) ; port PWR_CTRL.CORE_PWR_CN
DTU_DCD: U5.48(P4.6/S29) ; port Base_Board.DTU_DCD
DTU_ONOFF: U5.49(P4.5/S30) ; port Base_Board.DTU_ONOFF
GREEN: R24.2 ; port Tmp_Sensor.GREEN
IN0+: R23.1 U5.1(A0.0+)
IN0-: R24.1 U5.2(A0.0-)
IN1+: U5.3(A1.0+) ; port SD16_IN1.IN1+
IN1-: U5.4(A1.0-) ; port SD16_IN1.IN1-
IN2+: U5.5(A2.0+) ; port SD16_IN2.IN2+
IN2-: U5.6(A2.0-) ; port SD16_IN2.IN2-
IN4+: U5.12(A4.0+)
IN4-: U5.13(A4.0-)
IN5+: U5.14(A5.0+)
IN5-: U5.15(A5.0-)
LCDCAP: U5.63(LCDCAP/R33)
MCURXD0: U5.78(P2.5/UCA0RXD/UCA0SOMI) ; port MCU_UART.MCURXD0
MCURXD1: U5.84(P1.7/UCA1RXD/UCA1SOMI) ; port MCU_UART.MCURXD1
MCUTXD0: U5.79(P2.4/UCA0TXD/UCA0SIMO) ; port MCU_UART.MCUTXD0
MCUTXD1: U5.85(P1.6/UCA1TXD/UCA1SIMO) ; port MCU_UART.MCUTXD1
P1.0: U5.91(P1.0/TA0)
P1.1: R22.2 U5.90(P1.1/TA0/MCLK)
P1.2: K2.1 R26.2 U5.89(P1.2/TA1)
P1.3: K1.1 R25.2 U5.88(P1.3/TBOUTH/SVSOUT)
P1.4: U5.87(P1.4/TBCLK/SMCLK)
P2.0: U5.83(P2.0/UCB1STE/UCA1CLK)
P2.1: U5.82(P2.1/UCB1SIMO/UC1SDA)
P2.2: U5.81(P2.2/UCB1SOMI/UCB1SCL)
P2.3: U5.80(P2.3/UCB1CLK/UCA1STE)
P2.7: U5.76(P2.7/CA1) ; port MCU_IO.P2.7
P3.0: U5.75(P3.0/UCB0STE/UCA0CLK) ; port MCU_IO.P3.0
P3.1: U5.74(P3.1/UCB0SIMO/UCB0SDA) ; port MCU_IO.P3.1
P3.2: U5.73(P3.2/UCB0SOMI/UCB0SCL) ; port MCU_IO.P3.2
P3.3: U5.72(P3.3/UCB0CLK/UCA0STE) ; port MCU_IO.P3.3
P3.4: U5.71(P3.4/TA2/S39) ; port MCU_IO.P3.4
P3.6: U5.69(P3.6/TB1/S37) ; port MCU_IO.P3.6
P3.7: U5.68(P3.7/TB2/S36) ; port MCU_IO.P3.7
P4.1: U5.53(P4.1/DMAE0/S34) ; port MCU_IO.P4.1
P4.2: U5.52(P4.2/S33) ; port MCU_IO.P4.2
P4.3: U5.51(P4.3/S32) ; port MCU_IO.P4.3
P4.7: U5.47(P4.7/S28)
P5.0: U5.55(P5.0/SVSIN)
P5.1: U5.56(P5.1/COM0) ; port MCU_IO.P5.1
P5.2: U5.57(P5.2/COM1) ; port MCU_IO.P5.2
P5.3: U5.58(P5.3/COM2) ; port MCU_IO.P5.3
P5.4: U5.59(P5.4/COM3) ; port MCU_IO.P5.4
P5.5: U5.60(P5.5/R03)
P5.6: U5.61(P5.6/LCDREF/R13)
P5.7: U5.62(P5.7/R23)
P7.0: U5.46(P7.0/S27)
P7.1: U5.45(P7.1/S26)
P7.2: U5.44(P7.2/S25)
P7.3: U5.43(P7.3/S24)
P7.4: U5.42(P7.4/S23)
P7.5: U5.41(P7.5/S22)
P7.6: U5.40(P7.6/S21)
P7.7: U5.39(P7.7/S20)
P8.0: U5.38(P8.0/S19)
P8.1: U5.37(P8.1/S18)
P8.2: U5.36(P8.2/S17)
P8.3: U5.35(P8.3/S16)
P8.4: U5.34(P8.4/S15)
P8.5: U5.33(P8.5/S14)
P8.6: U5.32(P8.6/S13)
P8.7: U5.31(P8.7/S12)
P9.0: U5.30(P9.0/S11)
P9.1: U5.29(P9.1/S10)
P9.2: U5.28(P9.2/S9)
P9.6: U5.24(P9.6/S5)
P9.7: U5.23(P9.7/S4)
P10.3: R27.1 U5.19(P10.3/S0)
pulse: R27.2 ; port pulse
PWR_CN: U5.11(A3.0-) ; port PWR_CTRL.PWR_CN
RESET: C22.2 JP1.11 R16.1 S1.2 U5.100(~{RST}/NMI)
TCK: JP1.7 U5.99(TCK)
TDI: JP1.3 U5.97(TDI/TCLK)
TDO: JP1.1 U5.96(TD0/TDI)
TMS: JP1.5 U5.98(TMS)
TRAN_PWR_CN: U5.50(P4.4/S31) ; port Base_Board.TRAN_PWR_CN
VW_DRIVE: U5.70(P3.5/TB0/S38) ; port VW_CTRL.VW_DRIVE
VW_EN: U5.27(P9.3/S8) ; port VW_CTRL.VW_EN
VW_RA: U5.77(P2.6/CA0) ; port VW_CTRL.VW_RA
VW_RD: R21.1 U5.86(P1.5/TACLK/ACLK) ; port VW_CTRL.VW_RD
VW_TRCN: U5.26(P9.4/S7) ; port VW_CTRL.VW_TRCN
WHITE: R23.2 ; port Tmp_Sensor.WHITE
NetBT1_1: BT1.1(+) R17.2
NetC20_2: C20.2 U5.94(XT2IN) Y1.1(OSC1)
NetC21_2: C21.2 U5.93(XT2OUT) Y1.2(OSC2)
NetC26_1: C26.1 U5.65(XIN) Y2.1(X1)
NetC27_1: C27.1 U5.66(XOUT) Y2.4(X2)
NetD1_1: D1.1(A) R20.1
NetD1_2: D1.2(K) Q5.3
NetQ5_1: Q5.1 R22.1
NetR21_2: R21.2 U5.54(P4.0/CAOUT/S35)

Not connected (* = marked no-connect by the designer): JP1 4 6 8 10 12 13 14; U5 16(NC) 17(NC) 20(P10.2/S1) 21(P10.1/S2) 22(P10.0/S3)

### Notes on the sheet
- 文件版本:
- 原理图名:
- 工 程  名:
- 绘       制:
- 审       核:
- 第   页，共    页
- 日       期:

### Library data of the parts
BT1 = Battery: Multicell Battery; Type No.: MS920T
C20-C22 C26 C27 = Cap: Capacitor; Value: 100pF; Published: 8-Jun-2000; LatestRevisionDate: 17-Jul-2002; LatestRevisionNote: Re-released for DXP Platform.; PackageReference: RAD-0.3; Publisher: Altium Limited
C23-C25 = Cap: Capacitor
JP1 = Header2*7
K1 K2 = KEY_1
Q5 = NPN: Type No.: MMBT3904
R16 R25 R26 = Res2: Resistor; Value: 1K; Published: 8-Jun-2000; LatestRevisionDate: 17-Jul-2002; LatestRevisionNote: Re-released for DXP Platform.; PackageReference: AXIAL-0.4; Publisher: Altium Limited
R17-R24 R27 = Res2: Resistor
S1 = SW-PB: Switch; Published: 24-Mar-1999; LatestRevisionDate: 17-Jul-2002; LatestRevisionNote: Re-released for DXP Platform.; PackageReference: SPST-2; Publisher: Altium Limited
Y1 = XTAL: Crystal Oscillator; Published: 8-Jun-2000; LatestRevisionDate: 17-Jul-2002; LatestRevisionNote: Re-released for DXP Platform.; PackageReference: R38; Publisher: Altium Limited
Y2 = MC-146

## Sheet 8_Port.SchDoc
size A4
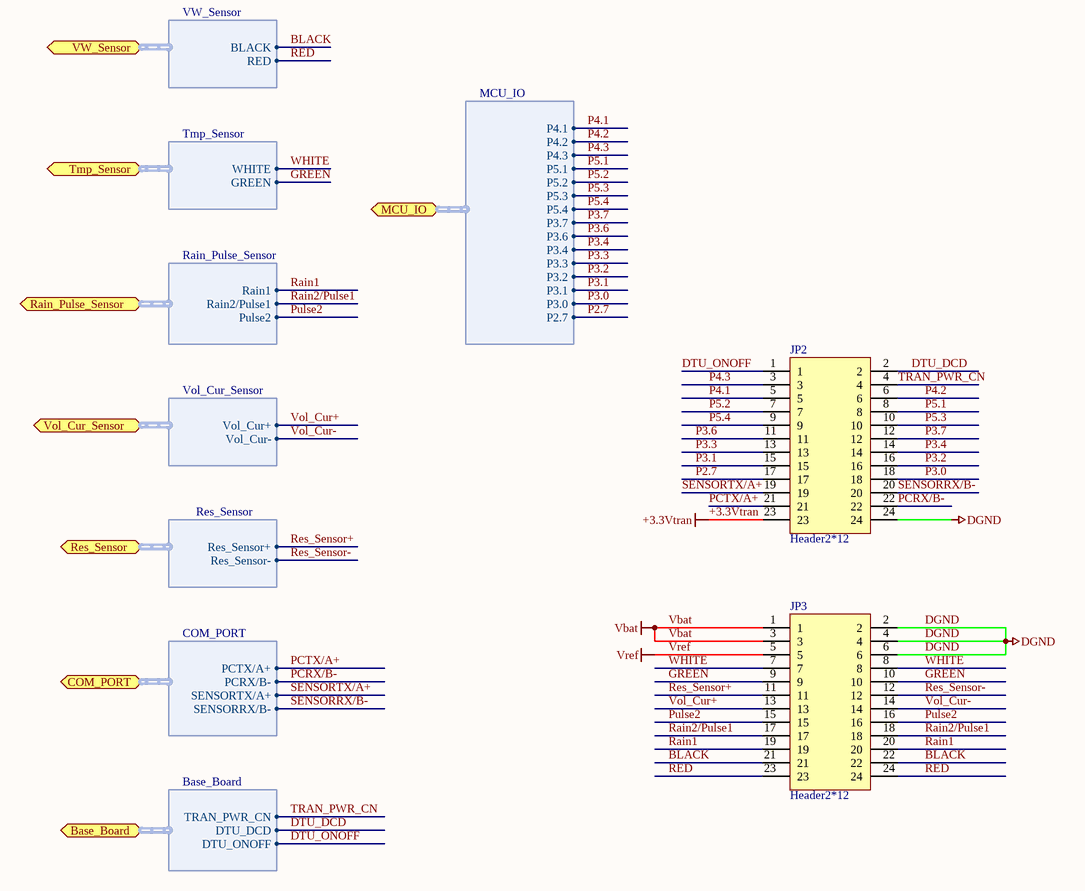
[diagram p8: 8_Port.SchDoc]

### Parts
JP2  Header2*12  [IDC24-2.0MM-INSERT]
JP3  Header2*12  [IDC24-2.0MM-INSERT]

### Ports
Base_Board (harness Base_Board), COM_PORT (harness COM_PORT), MCU_IO (harness MCU_IO), Rain_Pulse_Sensor (harness Rain_Pulse_Sensor), Res_Sensor (harness Res_Sensor), Tmp_Sensor (harness Tmp_Sensor), Vol_Cur_Sensor (harness Vol_Cur_Sensor), VW_Sensor (harness VW_Sensor)

### Harnesses
Rain_Pulse_Sensor: Rain1, Rain2/Pulse1, Pulse2
VW_Sensor: RED, BLACK
Vol_Cur_Sensor: Vol_Cur+, Vol_Cur-
Tmp_Sensor: GREEN, WHITE
Res_Sensor: Res_Sensor+, Res_Sensor-
COM_PORT: PCTX/A+, PCRX/B-, SENSORRX/B-, SENSORTX/A+
Base_Board: TRAN_PWR_CN, DTU_DCD, DTU_ONOFF
MCU_IO: P4.1, P4.2, P4.3, P5.1, P5.2, P5.3, P5.4, P3.0, P3.1, P3.2, P3.3, P3.4, P2.7, P3.6, P3.7

### Nets
+3.3Vtran: JP2.23
DGND: JP2.24 JP3.2 JP3.4 JP3.6
Vbat: JP3.1 JP3.3
Vref: JP3.5
BLACK: JP3.21 JP3.22 ; port VW_Sensor.BLACK
DTU_DCD: JP2.2 ; port Base_Board.DTU_DCD
DTU_ONOFF: JP2.1 ; port Base_Board.DTU_ONOFF
GREEN: JP3.9 JP3.10 ; port Tmp_Sensor.GREEN
P2.7: JP2.17 ; port MCU_IO.P2.7
P3.0: JP2.18 ; port MCU_IO.P3.0
P3.1: JP2.15 ; port MCU_IO.P3.1
P3.2: JP2.16 ; port MCU_IO.P3.2
P3.3: JP2.13 ; port MCU_IO.P3.3
P3.4: JP2.14 ; port MCU_IO.P3.4
P3.6: JP2.11 ; port MCU_IO.P3.6
P3.7: JP2.12 ; port MCU_IO.P3.7
P4.1: JP2.5 ; port MCU_IO.P4.1
P4.2: JP2.6 ; port MCU_IO.P4.2
P4.3: JP2.3 ; port MCU_IO.P4.3
P5.1: JP2.8 ; port MCU_IO.P5.1
P5.2: JP2.7 ; port MCU_IO.P5.2
P5.3: JP2.10 ; port MCU_IO.P5.3
P5.4: JP2.9 ; port MCU_IO.P5.4
PCRX/B-: JP2.22 ; port COM_PORT.PCRX/B-
PCTX/A+: JP2.21 ; port COM_PORT.PCTX/A+
Pulse2: JP3.15 JP3.16 ; port Rain_Pulse_Sensor.Pulse2
Rain1: JP3.19 JP3.20 ; port Rain_Pulse_Sensor.Rain1
Rain2/Pulse1: JP3.17 JP3.18 ; port Rain_Pulse_Sensor.Rain2/Pulse1
RED: JP3.23 JP3.24 ; port VW_Sensor.RED
Res_Sensor+: JP3.11 ; port Res_Sensor.Res_Sensor+
Res_Sensor-: JP3.12 ; port Res_Sensor.Res_Sensor-
SENSORRX/B-: JP2.20 ; port COM_PORT.SENSORRX/B-
SENSORTX/A+: JP2.19 ; port COM_PORT.SENSORTX/A+
TRAN_PWR_CN: JP2.4 ; port Base_Board.TRAN_PWR_CN
Vol_Cur+: JP3.13 ; port Vol_Cur_Sensor.Vol_Cur+
Vol_Cur-: JP3.14 ; port Vol_Cur_Sensor.Vol_Cur-
WHITE: JP3.7 JP3.8 ; port Tmp_Sensor.WHITE

## Nets that join several sheets
+3.3Vcoll: 1_Power_Supply (C8.1 C9.2 U2.5), 3_VW_Sensor (13 pins), 5_Current_Voltage_Sensor (C48.1 C49.2 R55.2 U10.5), 6_Pulse_Sensor (C50.1 C51.2 R66.1 U11.6), 7_RS485_RS232_Sensor (D4.2 U14.5)
+3.3Vcore: 1_Power_Supply (C13.1 C14.2 U3.5), 2_MCU_MSP430 (11 pins)
+3.3Vtran: 7_RS485_RS232_Sensor (D4.1), 8_Port (JP2.23)
DGND: 1_Power_Supply (31 pins), 3_VW_Sensor (14 pins), 4_Resistor_Sensor (C46.2 C47.2), 5_Current_Voltage_Sensor (6 pins), 6_Pulse_Sensor (5 pins), 7_RS485_RS232_Sensor (9 pins), 2_MCU_MSP430 (19 pins), 8_Port (JP2.24 JP3.2 JP3.4 JP3.6)
Vbat: 1_Power_Supply (7 pins), 8_Port (JP3.1 JP3.3)
Vcoll: 1_Power_Supply (Q1.3), 3_VW_Sensor (5 pins), 6_Pulse_Sensor (R64.1 R65.1)
Vref: 1_Power_Supply (C18.1 C19.2 R6.1 U4.5), 2_MCU_MSP430 (U5.9), 8_Port (JP3.5)
BLACK: 3_VW_Sensor (RE1.3), 8_Port (JP3.21 JP3.22)
COLL_PWR_CN: 1_Power_Supply (R4.1 R12.1 U2.3), 2_MCU_MSP430 (U5.25)
CORE_PWR_CN: 1_Power_Supply (R5.1 R13.1 U3.3), 2_MCU_MSP430 (U5.10)
DTU_DCD: 2_MCU_MSP430 (U5.48), 8_Port (JP2.2)
DTU_ONOFF: 2_MCU_MSP430 (U5.49), 8_Port (JP2.1)
GREEN: 2_MCU_MSP430 (R24.2), 8_Port (JP3.9 JP3.10)
IN1+: 5_Current_Voltage_Sensor (R57.2 U10.8), 2_MCU_MSP430 (U5.3)
IN1-: 5_Current_Voltage_Sensor (R63.1), 2_MCU_MSP430 (U5.4)
IN2+: 4_Resistor_Sensor (R52.1), 2_MCU_MSP430 (U5.5)
IN2-: 4_Resistor_Sensor (R54.1), 2_MCU_MSP430 (U5.6)
MCURXD0: 7_RS485_RS232_Sensor (R72.1 R81.1), 2_MCU_MSP430 (U5.78)
MCURXD1: 7_RS485_RS232_Sensor (R77.1 R85.1), 2_MCU_MSP430 (U5.84)
MCUTXD0: 7_RS485_RS232_Sensor (R70.1 R79.1), 2_MCU_MSP430 (U5.79)
MCUTXD1: 7_RS485_RS232_Sensor (R74.1 R88.1), 2_MCU_MSP430 (U5.85)
P2.7: 2_MCU_MSP430 (U5.76), 8_Port (JP2.17)
P3.0: 2_MCU_MSP430 (U5.75), 8_Port (JP2.18)
P3.1: 2_MCU_MSP430 (U5.74), 8_Port (JP2.15)
P3.2: 2_MCU_MSP430 (U5.73), 8_Port (JP2.16)
P3.3: 2_MCU_MSP430 (U5.72), 8_Port (JP2.13)
P3.4: 2_MCU_MSP430 (U5.71), 8_Port (JP2.14)
P3.6: 2_MCU_MSP430 (U5.69), 8_Port (JP2.11)
P3.7: 2_MCU_MSP430 (U5.68), 8_Port (JP2.12)
P4.1: 2_MCU_MSP430 (U5.53), 8_Port (JP2.5)
P4.2: 2_MCU_MSP430 (U5.52), 8_Port (JP2.6)
P4.3: 2_MCU_MSP430 (U5.51), 8_Port (JP2.3)
P5.1: 2_MCU_MSP430 (U5.56), 8_Port (JP2.8)
P5.2: 2_MCU_MSP430 (U5.57), 8_Port (JP2.7)
P5.3: 2_MCU_MSP430 (U5.58), 8_Port (JP2.10)
P5.4: 2_MCU_MSP430 (U5.59), 8_Port (JP2.9)
PCRX/B-: 7_RS485_RS232_Sensor (R73.2 R78.2), 8_Port (JP2.22)
PCTX/A+: 7_RS485_RS232_Sensor (R71.2 R80.2), 8_Port (JP2.21)
pulse: 6_Pulse_Sensor (R66.2 U11.5), 2_MCU_MSP430 (R27.2)
Pulse2: 6_Pulse_Sensor (R68.1), 8_Port (JP3.15 JP3.16)
PWR_CN: 1_Power_Supply (R2.1 U1.1), 2_MCU_MSP430 (U5.11)
Rain1: 6_Pulse_Sensor (R65.2), 8_Port (JP3.19 JP3.20)
Rain2/Pulse1: 6_Pulse_Sensor (R67.1), 8_Port (JP3.17 JP3.18)
RED: 3_VW_Sensor (RE1.6), 8_Port (JP3.23 JP3.24)
Res_Sensor+: 4_Resistor_Sensor (R51.2), 8_Port (JP3.11)
Res_Sensor-: 4_Resistor_Sensor (R53.2), 8_Port (JP3.12)
SENSORRX/B-: 7_RS485_RS232_Sensor (R76.2 R84.2), 8_Port (JP2.20)
SENSORTX/A+: 7_RS485_RS232_Sensor (R75.2 R87.2), 8_Port (JP2.19)
TRAN_PWR_CN: 2_MCU_MSP430 (U5.50), 8_Port (JP2.4)
Vol_Cur+: 5_Current_Voltage_Sensor (R58.2), 8_Port (JP3.13)
Vol_Cur-: 5_Current_Voltage_Sensor (R61.2), 8_Port (JP3.14)
VW_DRIVE: 3_VW_Sensor (U6.2), 2_MCU_MSP430 (U5.70)
VW_EN: 3_VW_Sensor (R31.1 U6.3), 2_MCU_MSP430 (U5.27)
VW_RA: 3_VW_Sensor (R44.2), 2_MCU_MSP430 (U5.77)
VW_RD: 3_VW_Sensor (R49.2 U9.1), 2_MCU_MSP430 (R21.1 U5.86)
VW_TRCN: 3_VW_Sensor (R30.1), 2_MCU_MSP430 (U5.26)
WHITE: 2_MCU_MSP430 (R23.2), 8_Port (JP3.7 JP3.8)